# EAGLE design PCB-RS422_485-DB9 (EAGLE 7.5.0)

## Sheet 1 of 2
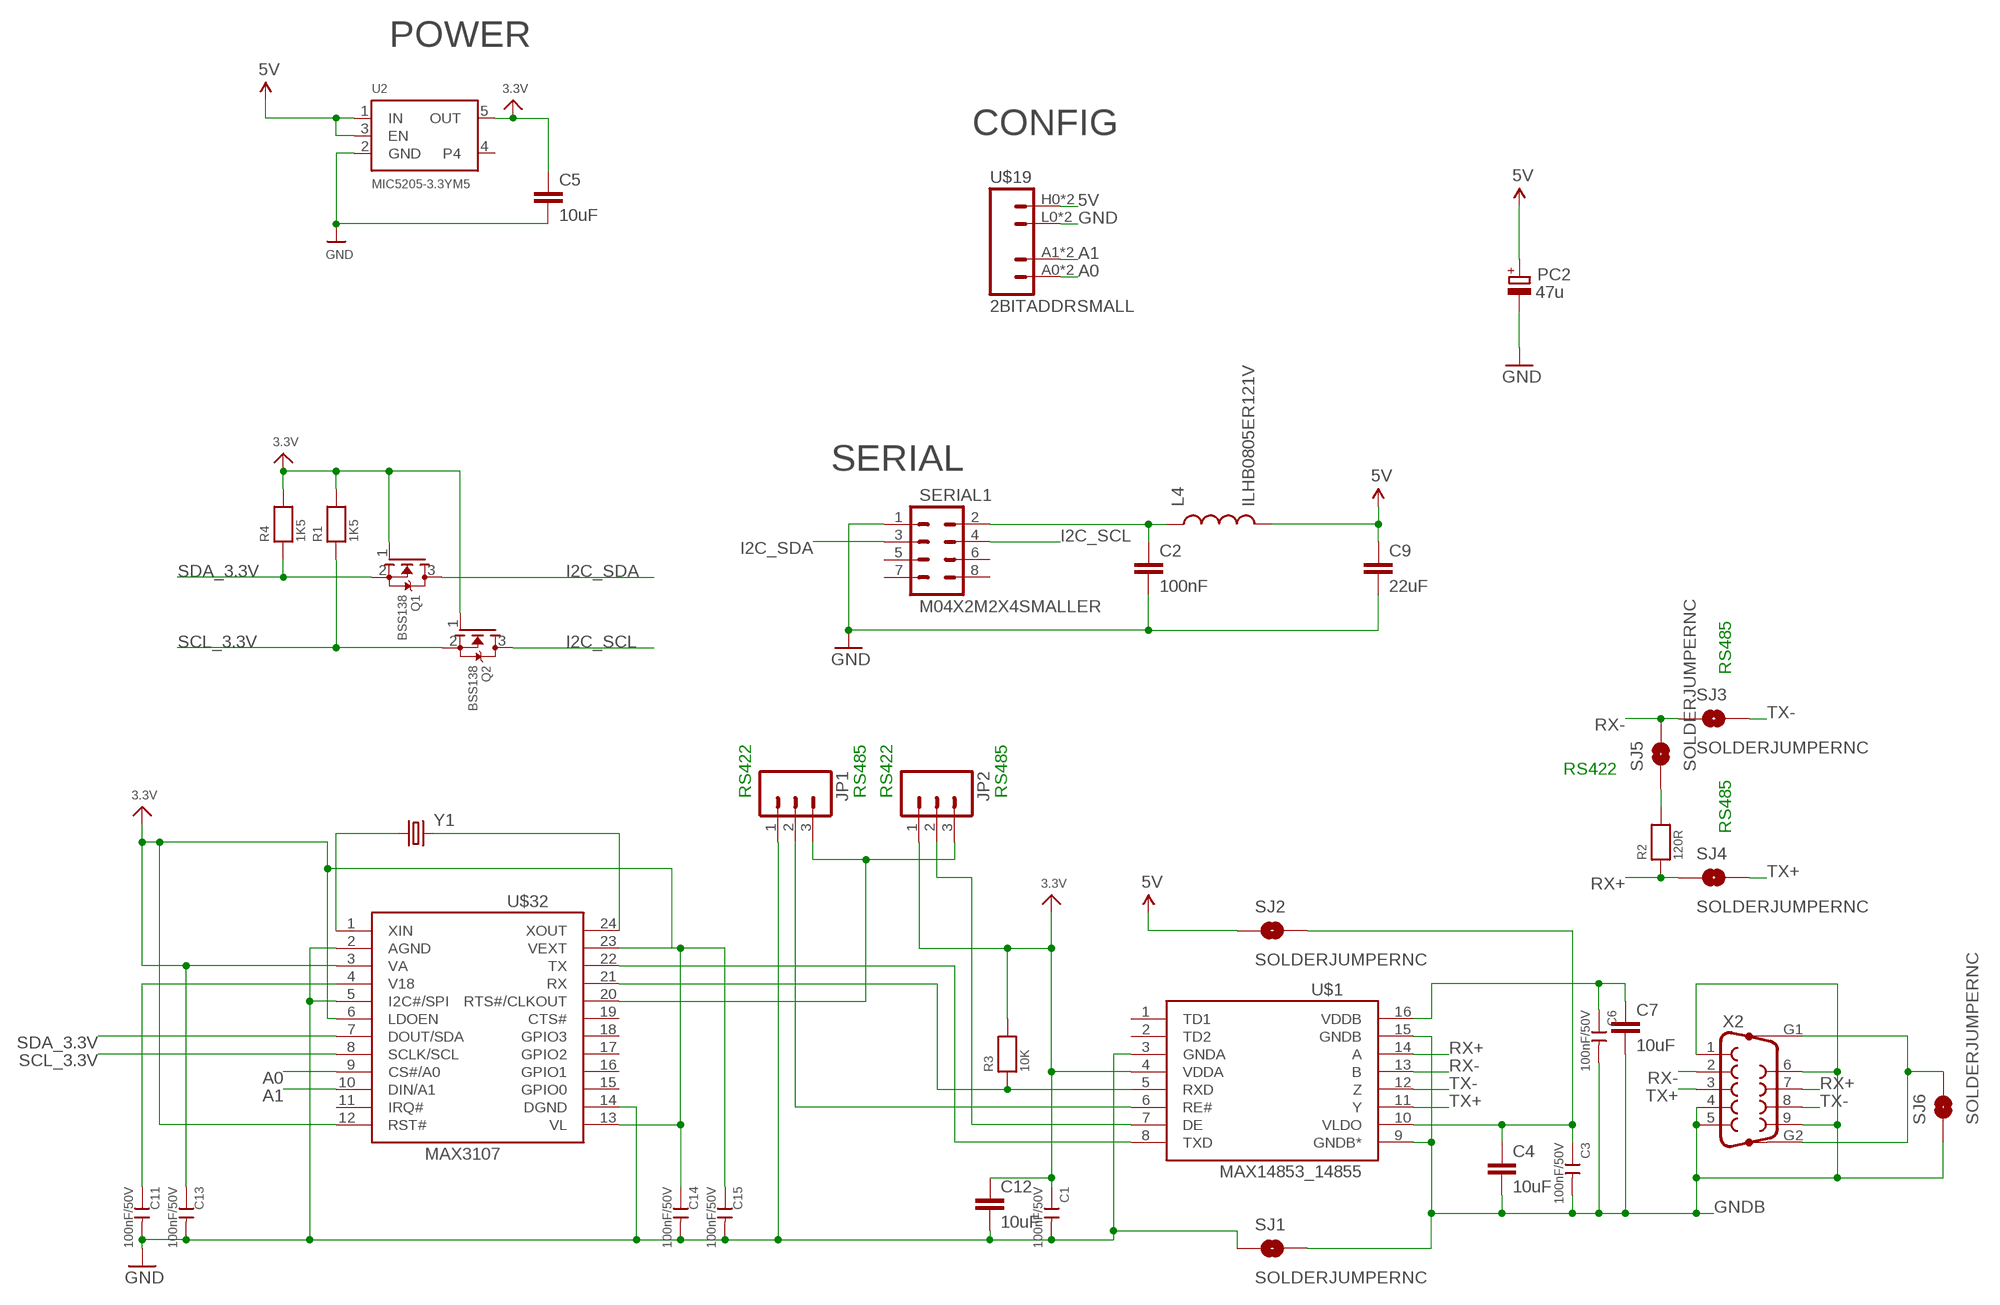
[diagram p0: schematic, sheet 1]

### Parts
C1  100nF/50V  CAP-0603  [C0603]
C2  100nF  CAP0603-CAP  [0603-CAP]
C3  100nF/50V  CAP-0603  [C0603]
C4  10uF  CAP0805  [0805]
C5  10uF  CAP0805  [0805]
C6  100nF/50V  CAP-0603  [C0603]
C7  10uF  CAP0805  [0805]
C9  22uF  CAP0805  [0805]
C11  100nF/50V  CAP-0603  [C0603]
C12  10uF  CAP0805  [0805]
C13  100nF/50V  CAP-0603  [C0603]
C14  100nF/50V  CAP-0603  [C0603]
C15  100nF/50V  CAP-0603  [C0603]
JP1  M03LOCK  [1X03_LOCK]
JP2  M03LOCK  [1X03_LOCK]
L4  ILHB0805ER121V  INDUCTOR0805  [0805]
PC2  47u  CPOL-EUD  [PANASONIC_D]
Q1  BSS138  MOSFET-NREFLOW  [SOT23-R]
Q2  BSS138  MOSFET-NREFLOW  [SOT23-R]
R1  1K5  RESISTOR0603  [0603]
R2  120R  RESISTOR0603  [0603]
R3  10K  RESISTOR0603  [0603]
R4  1K5  RESISTOR0603  [0603]
SERIAL1  M04X2M2X4SMALLER  [M2X4SMALLER]
SJ1  SOLDERJUMPERNC  [SJ_2S]
SJ2  SOLDERJUMPERNC  [SJ_2S]
SJ3  SOLDERJUMPERNC  [SJ_2S]
SJ4  SOLDERJUMPERNC  [SJ_2S]
SJ5  SOLDERJUMPERNC  [SJ_2S]
SJ6  SOLDERJUMPERNC  [SJ_2S]
U2  MIC5205-3.3YM5  VREG_SOT23-5  [SOT23-5]
U$1  MAX14853_14855  [SO-16W]
U$19  2BITADDRSMALL  [2BITADDR_SMALL]
U$32  MAX3107  [SSOP24]
X2  F09HP  [F09HP]
Y1  CRYSTALHC49US  [HC49US]

### Nets
3.3V [Power]: C1.1 C5.1 C12.1 C13.1 C14.1 C15.1 JP2.1 Q1.1(G) Q2.1(G) R1.2 R3.2 R4.2 U2.5(OUT) U$1.4(VDDA) U$32.3(VA) U$32.6(LDOEN) U$32.12(RST#) U$32.13(VL) U$32.23(VEXT)
5V [Power]: C9.1 L4.2 PC2.+ SJ2.1 U2.1(IN) U2.3(EN) U$19.H0(VCC) U$19.H1(VCC)
A0: U$19.A0(A1) U$19.AS0(A1) U$32.9(CS#/A0)
A1: U$19.A1(A2) U$19.AS1(A2) U$32.10(DIN/A1)
GND [Power]: C1.2 C2.2 C5.2 C9.2 C11.2 C12.2 C13.2 C14.2 C15.2 JP1.1 PC2.- SERIAL1.1 SJ1.1 U2.2(GND) U$1.3(GNDA) U$19.L0(GND) U$19.L1(GND) U$32.2(AGND) U$32.5(I2C#/SPI) U$32.14(DGND)
GNDB [Power]: C3.2 C4.2 C6.2 C7.2 SJ1.2 SJ6.1 U$1.9(GNDB*) U$1.15(GNDB) X2.1 X2.4 X2.5 X2.6 X2.9
I2C_SCL: Q2.3(D) SERIAL1.4
I2C_SDA: Q1.3(D) SERIAL1.3
N$1: U$1.8(TXD) U$32.22(TX)
N$2: R3.1 U$1.5(RXD) U$32.21(RX)
N$3 [Power]: C2.1 L4.1 SERIAL1.2
N$4: R2.2 SJ5.1
N$5 [Power]: C3.1 C4.1 SJ2.2 U$1.10(VLDO)
N$6: C11.1 U$32.4(V18)
N$7: JP2.2 U$1.7(DE)
N$8: JP1.2 U$1.6(RE#)
N$9 [Power]: SJ6.2 X2.G1 X2.G2
N$10: JP1.3 JP2.3 U$32.20(RTS#/CLKOUT)
N$11: U$32.1(XIN) Y1.1
N$12: C6.1 C7.1 U$1.16(VDDB)
N$27: U$32.24(XOUT) Y1.2
RX+: R2.1 SJ4.1 U$1.14(A) X2.7
RX-: SJ3.1 SJ5.2 U$1.13(B) X2.2
SCL_3.3V: Q2.2(S) R1.1 U$32.8(SCLK/SCL)
SDA_3.3V: Q1.2(S) R4.1 U$32.7(DOUT/SDA)
TX+: SJ4.2 U$1.11(Y) X2.3
TX-: SJ3.2 U$1.12(Z) X2.8
Unconnected: SERIAL1.5 SERIAL1.6 SERIAL1.7 SERIAL1.8 U2.4 U$1.1(TD1) U$1.2(TD2) U$32.11(IRQ#) U$32.15(GPIO0) U$32.16(GPIO1) U$32.17(GPIO2) U$32.18(GPIO3) U$32.19(CTS#)

### Notes on the sheet
- POWER
- CONFIG
- SERIAL
- RS485
- RS422
- RS422 | RS485 | RS422 | RS485
- RS485

## Sheet 2 of 2

## Library data of the parts
C1 C3 C6 C11 C13-C15 = OPL:CAP: Ceramic Capacitors
C2 C4 C5 C7 C9 C12 = SparkFun:CAP: Capacitor Standard 0603 ceramic capacitor, and 0.1" leaded capacitor.
JP1 JP2 = SparkFun:M03: Header 3 Standard 3-pin 0.1" header. Use with straight break away headers (SKU : PRT-00116), right angle break away headers (PRT-00553), swiss pins (PRT-00743), machine pins (PRT-00117), and female headers (PRT-00115). Molex polarized connector foot print use with SKU : PRT-08232 with associated crimp pins and housings.
L4 = SparkFun:INDUCTOR: Inductors Basic Inductor/Choke - 0603 and 1206. Footprints are not proven and vary greatly between part numbers.
PC2 = rcl:CPOL-EU: POLARIZED CAPACITOR, European symbol
Q1 Q2 = microbuilder:MOSFET-N: N-Channel Mosfet LEGEND VDS: Voltage Drain-Source ID: Drain Current RDS(ON): Drain-Source On-State Resistance VGS(TH): Gate-Source Threshold Voltage CISS: Drain-Source Input Capacitance SOT-23 Name VDS ID RDS(ON) VGS(TH) CISS Order Number 2N7002E 60V 260mA 2.5 Ohm 2.5V @ 250uA 26.7pF @ 25V 2N7002ET1GOSTR-ND BSH103 30V 850mA 400 mOhm 400mV @ 1mA 83pF @ 24V BSH103,235-ND BSS138 60V 320mA 1.6 Ohm 1.5V @ 250uA 50pF @ 10V Mouser: 771-BSS138PW115 DMN2075U-7 20V 4.2A 38 mOhm 1V @ 250 uA 594.3pF @ 10V DMN2075U-7DICT-ND * BSS138 good choice for I2C level-shifting
R1-R4 = microbuilder:RESISTOR: Resistors 0402 - 0402 Surface Mount Package 22 Ohm 1% 1/16W [Digikey: 311-22.0LRTR-ND] 33 Ohm 5% 1/16W 1.0K 5% 1/16W 1.5K 5% 1/16W 2.0K 1% 1/16W 10.0K 1% 1/16W [Digikey: 311-10.0KLRTR-ND] 10.0K 5% 1/16W [Digikey: RMCF0402JT10K0TR-ND] 12.1K 1% 1/16W [Digikey: 311-22.0LRTR-ND] 100.0K 5% 1/16W 0603 - 0603 Surface Mount Package 0 Ohm 1/10 Watt 1% Resistor 15 Ohm 1/10 Watt 1% Resistor 33 Ohm 1/10 Watt 1% Resistor 49.9 Ohm 1/10 Watt 1% Resistor 100 Ohm 1/10 Watt 1% Resistor 150 Ohm 1/10 Watt 1% Resistor 240 Ohm 1/10 Watt 1% Resistor 390 Ohm 1/10 Watt 1% Resistor 560 Ohm 1/10 Watt 1% Resistor 680 Ohm 1/10 Watt 1% Resistor 750 Ohm 1/10 Watt 1% Resistor 1.0K Ohm 1/10 Watt 1% Resistor 1.5K Ohm 1/10 Watt 1% Resistor 2.0K Ohm 1/10 Watt 1% Resistor 2.2K Ohm 1/10 Watt 1% Resistor 3.3K Ohm 1/10 Watt 1% Resistor 4.7K Ohm 1/10 Watt 1% Resistor 10.0K Ohm 1/10 Watt 1% Resistor 12.0K Ohm 1/10 Watt 1% Resistor 12.1K Ohm 1/10 Watt 1% Resistor 20.0K Ohm 1/10 Watt 1% Resistor 33.0K Ohm 1/10 Watt 1% Resistor 100.0K Ohm 1/10 Watt 1% Resistor 0805 - 0805 Surface Mount Package 0 Ohm 1/8 Watt 1% Resistor 33 Ohm 1/8 Watt 1% Resistor 100 Ohm 1/8 Watt 1% Resistor 150 Ohm 1/8 Watt 1% Resistor 200 Ohm 1/8 Watt 1% Resistor 240 Ohm 1/8 Watt 1% Resistor 330 Ohm 1/8 Watt 1% Resistor 390 Ohm 1/8 Watt 1% Resistor 470 Ohm 1/8 Watt 1% Resistor 1.0K Ohm 1/8 Watt 1% Resistor 1.5K Ohm 1/8 Watt 1% Resistor 2.0K Ohm 1/8 Watt 1% Resistor 4.7K Ohm 1/8 Watt 1% Resistor 5.1K Ohm 1/8 Watt 1% Resistor 5.6K Ohm 1/8 Watt 1% Resistor 10.0K Ohm 1/8 Watt 1% Resistor 22.0K Ohm 1/8 Watt 1% Resistor 33.0K Ohm 1/8 Watt 1% Resistor 100K Ohm 1/8 Watt 1% Resistor 1206 - 1206 Surface Mount Package 2012 - 2010 Surface Mount Package 0.11 Ohm 1/2 Watt 1% Resistor - Digikey: RHM.11UCT-ND
SERIAL1 = SKAARHOJ:M04X2
SJ1-SJ6 = SparkFun:SOLDERJUMPER: Solder Jumper Standard SMD solder jumper. Used to automate production. Two varients : Normally Open and Normally Closed are the same, but have different paste layers. NC will have a large amount of paste and should jumper during reflow.
U2 = microbuilder:VREG_SOT23-5: SOT23-5 Fixed Voltage Regulators To better organise some of the SOT23-5 fixed voltage regulators in this library, this new part was created. Part Current Out V Out V In V Dropout Digikey Part No. ADP121 150mA 3.3V 3.4-5.5V 0.09V @ 150mA ADP121-AUJZ33R7CT-ND ADP121 150mA 3.0V 3.1-5.5V 0.09V @ 150mA ADP121-AUJZ30R7CT-ND ADP122 300mA 3.3V 3.4-5.5V 0.085V @ 300mA ADP122AUJZ-3.3-R7CT-ND ADP1712 300mA 3.3V 3.5-5.5V 0.17V @ 300mA ADP1712AUJZ-3.3-R7TR-ND AP7311 (Low Cost) 150mA 3.3V 3.5-6V 0.15V @ 150mA AP7311-33WG-7DICT-ND LD39015M18R 150mA 1.8V 1.9V-5.5V 0.08V @ 100mA 497-6977-1-ND MCP1824T-3302E/OT 300mA 3.3V 3.5V-6V 0.2V @ 300mA MCP1824T-3302E/OTCT-ND MIC5205-2.5YM5 TR 150mA 2.5V 2.7-16V 0.165V @ 150mA 576-1257-2-ND MIC5205-3.0YM5 TR 150mA 3.0V 3.2V-16V 0.165V @ 150mA 576-1258-2-ND MIC5205-3.3YM5 TR 150mA 3.3V 3.5V-16V 0.165V @ 150mA 576-1259-2-ND TPS780330220 150mA 3.3V+2.2V 3.6-5.5V 250mV Max 296-23332-1-ND TDA3663/N1,135 100mA 3.3V 3.5-45V 0.18V @ 50mA 568-5343-1-ND
U$1 = SKAARHOJ:MAX14853_14855
U$19 = SKAARHOJ:2BITADDR
U$32 = SKAARHOJ:MAX3107
X2 = con-subd:F09HP: SUB-D; OC_FARNELL: unknown; OC_NEWARK: unknown
Y1 = SparkFun:CRYSTAL: Crystals Various standard crystals. Proven footprints. Spark Fun Electronics SKU : COM-00534

## Net classes
0 default: width 0.203 mm, drill 0.406 mm, clearance 0.203 mm
1 Power: width 0.406 mm, drill 0.61 mm, clearance 0.203 mm
2 RELAY LINES: width 0.305 mm, drill 0.406 mm, clearance 0.254 mm
3 INput lines: width 0.203 mm, drill 0.406 mm, clearance 0.254 mm

## Board
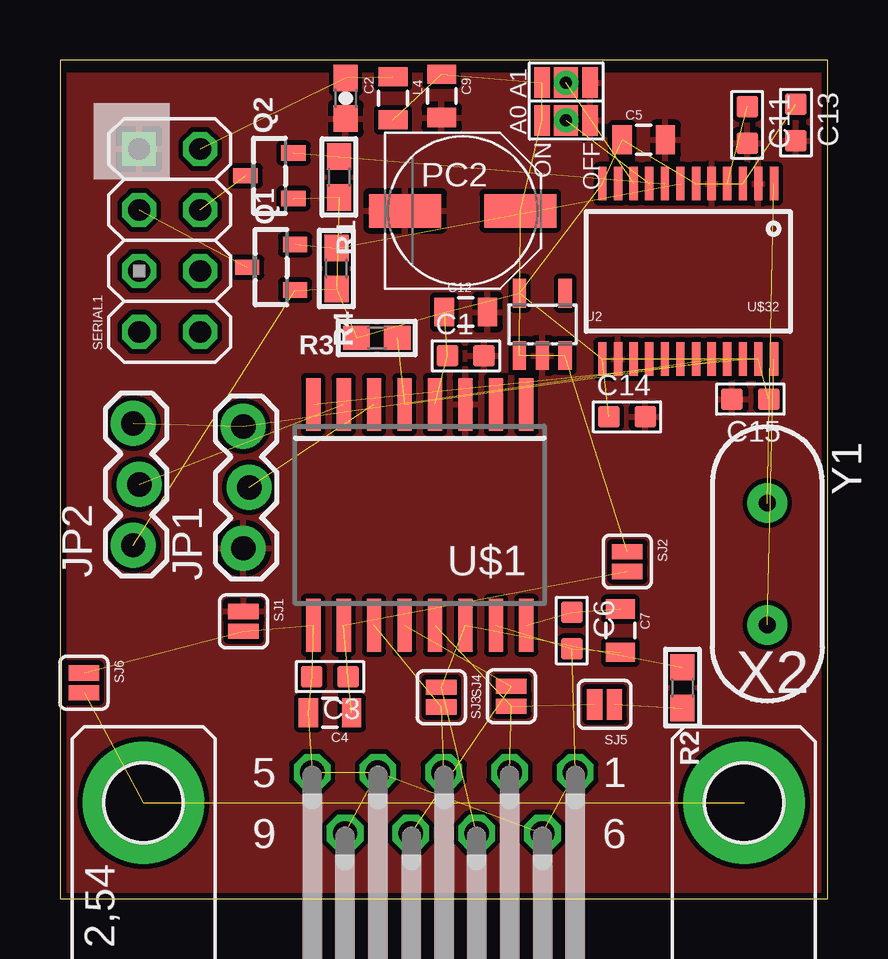
[diagram p1: board, top side]
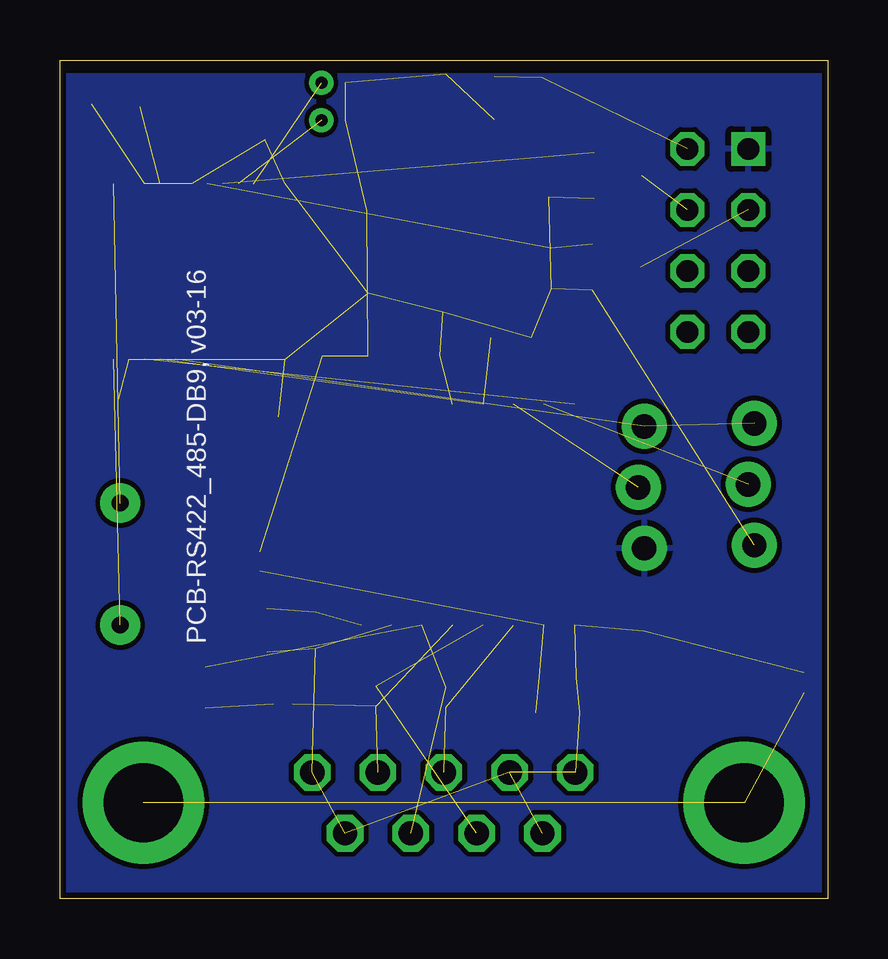
[diagram p2: board, bottom side, seen from below]

Size 32 x 34.95 mm. Coordinates in mm from the lower left corner, seen from the top.
Outline: 32,0 32,34.95 0,34.95 0,0 32,0
Copper layers (1*16): Top 0.035mm / dielectric 1.5mm / Bottom 0.035mm
Design rules "Fusion_eagle_rule_v1.1": minimum track width 6mil, minimum drill 12mil, track to track 6mil, track to pad 6mil, pad to pad 6mil, via to via 6mil, smd to smd 0mil, copper to edge 10mil, drill to drill 10mil, minimum pad ring 10mil, minimum via ring 6mil, stop-mask expansion 2mil, vias tented up to drill 100mil, thermal gap 10mil

### Footprints (pad centres in the part's own frame; a part is rotated, then mirrored left to right if it is on the bottom)
C0603 = smd 0.889 x 0.889: 1 -0.762,0; 2 0.762,0
0603-CAP = smd 1.1 x 1: 1 -0.85,0; 2 0.85,0
0805 = smd 0.8 x 1.2: 1 -0.9,0; 2 0.9,0
1X03_LOCK = drill 1.016 pad 1.88: 1 0,0.127; 2 2.54,-0.127; 3 5.08,0.127
PANASONIC_D = smd 3 x 1.4: + 2.4,0; - -2.4,0
SOT23-R = smd 0.635 x 1.016: 1 -0.95,-1; 2 0.95,-1; 3 0,1
0603 = smd 1.1 x 1: 1 -0.85,0; 2 0.85,0
M2X4SMALLER = drill 0.9 square: 1 -1.27,3.81 | drill 0.9 octagon: 2 1.27,3.81; 3 -1.27,1.27; 4 1.27,1.27; 5 -1.27,-1.27; 6 1.27,-1.27; 7 -1.27,-3.81; 8 1.27,-3.81
SJ_2S = smd 0.635 x 1.27: 1 -0.412,0; 2 0.412,0
SOT23-5 = smd 0.55 x 1.2: 1 -0.95,-1.3; 2 0,-1.3; 3 0.95,-1.3; 4 0.95,1.3; 5 -0.95,1.3
SO-16W = smd 0.6 x 2.2: 1 -4.445,-4.6; 2 -3.175,-4.6; 3 -1.905,-4.6; 4 -0.635,-4.6; 5 0.635,-4.6; 6 1.905,-4.6; 7 3.175,-4.6; 8 4.445,-4.6; 9 4.445,4.6; 10 3.175,4.6; 11 1.905,4.6; 12 0.635,4.6; 13 -0.635,4.6; 14 -1.905,4.6; 15 -3.175,4.6; 16 -4.445,4.6
2BITADDR_SMALL = drill 0.5: A0 -1.565,0; A1 0,0 | smd 1.27 x 1: AS0 -1.565,0; AS1 0,0 | smd 1.27 x 0.635: H0 -1.565,1; H1 0,1; L0 -1.565,-1; L1 0,-1
SSOP24 = smd 0.348 x 1.397: 1 -3.575,-3.656; 2 -2.925,-3.656; 3 -2.275,-3.656; 4 -1.625,-3.656; 5 -0.975,-3.656; 6 -0.325,-3.656; 7 0.325,-3.656; 8 0.975,-3.656; 9 1.625,-3.656; 10 2.275,-3.656; 11 2.925,-3.656; 12 3.575,-3.656; 13 3.575,3.656; 14 2.925,3.656; 15 2.275,3.656; 16 1.625,3.656; 17 0.975,3.656; 18 0.325,3.656; 19 -0.325,3.656; 20 -0.975,3.656; 21 -1.625,3.656; 22 -2.275,3.656; 23 -2.925,3.656; 24 -3.575,3.656
F09HP = drill 1.016 octagon: 1 -5.486,-1.27; 2 -2.743,-1.27; 3 0,-1.27; 4 2.743,-1.27; 5 5.486,-1.27; 6 -4.115,1.27; 7 -1.372,1.27; 8 1.372,1.27; 9 4.115,1.27 | drill 3.302 pad 5.08: G1 -12.522,0; G2 12.522,0
HC49US = drill 0.7 pad 1.651: 1 -2.54,0; 2 2.54,0

### Placement (x,y rotation side)
C1  16.92,22.62 0 top
C2  11.92,33.36 270 top
C3  11.25,9.25 180 top
C4  11.25,7.75 180 top
C5  24.34,31.63 0 top
C6  21.34,11.18 270 top
C7  23.37,11.18 270 top
C9  15.92,33.45 270 top
C11  28.65,32.24 270 top
C12  16.92,24.45 0 top
C13  30.68,32.34 270 top
C14  23.64,20.08 0 top
C15  28.78,20.82 180 top
JP1  7.77,14.6 90 top
JP2  3.18,14.73 90 top
L4  13.88,33.36 270 top
PC2  16.79,28.66 0 top
Q1  8.8,26.32 90 top
Q2  8.74,30.13 90 top
R1  11.63,30.07 270 top
R2  25.95,8.8 270 top
R3  13.21,23.37 180 top
R4  11.52,26.26 270 top
SERIAL1  4.57,27.43 0 top
SJ1  7.65,11.56 270 top
SJ2  23.65,14.05 270 top
SJ3  18.81,8.44 90 top
SJ4  15.9,8.4 270 top
SJ5  22.71,8.1 180 top
SJ6  1,9 270 top
U2  20.11,23.93 0 top
U$1  15,16 180 top
U$19  21.1,34 90 top
U$32  26.19,26.14 180 top
X2  16,4 180 top
Y1  29.49,13.95 270 top

### Tracks (layer width: path | path; a pad name or v marks a point on that pad's centre or on a via)
3.3V  (18 unrouted)
5V  (7 unrouted)
A0  (1 unrouted)
A1  (1 unrouted)
GND
  pour Top: 0,0 31.75,0 31.75,34.29 0,34.29
  pour Bottom: 0,0 31.75,0 31.75,34.29 0,34.29
GNDB  (12 unrouted)
I2C_SCL  (1 unrouted)
I2C_SDA  (1 unrouted)
N$1  (1 unrouted)
N$2  (2 unrouted)
N$3  (2 unrouted)
N$4  (1 unrouted)
N$5  (3 unrouted)
N$6  (1 unrouted)
N$7  (1 unrouted)
N$8  (1 unrouted)
N$9  (2 unrouted)
N$10  (2 unrouted)
N$11  (1 unrouted)
N$12  (2 unrouted)
N$27  (1 unrouted)
RX+  (3 unrouted)
RX-  (3 unrouted)
SCL_3.3V  (2 unrouted)
SDA_3.3V  (2 unrouted)
TX+  (2 unrouted)
TX-  (2 unrouted)

### Text on the board
_bsilk: PCB-RS422_485-DB9, v03-16